# EAGLE design serialstick (EAGLE 5.11)
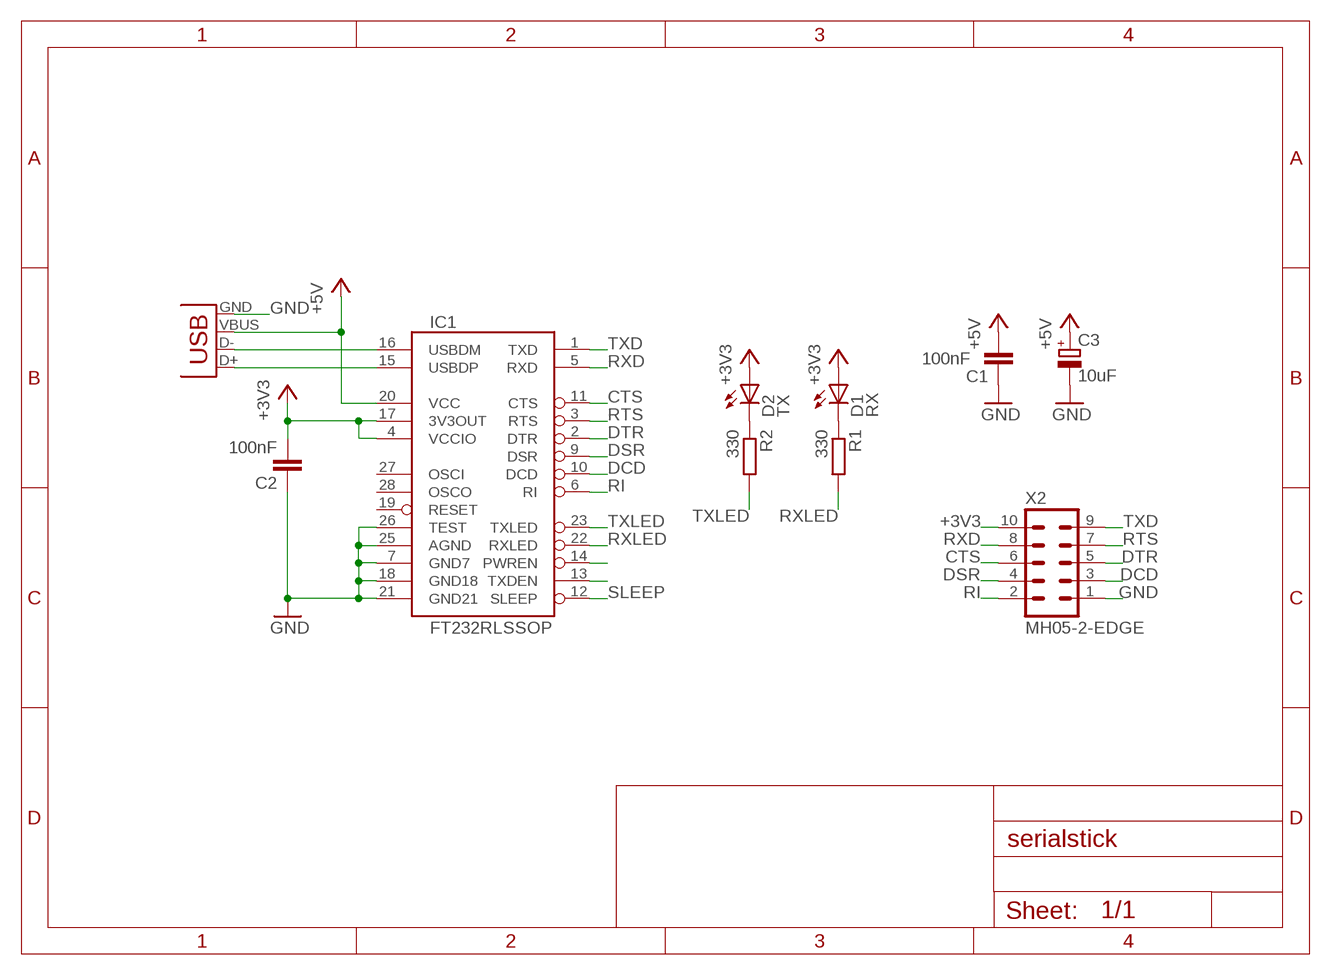
[diagram p0: schematic, sheet 1]

## Parts
C1  100nF  C-EUC0603  [C0603]
C2  100nF  C-EUC0603  [C0603]
C3  10uF  CPOL-EUSMCA  [SMC_A]
D1  RX  LED1206  [1206]
D2  TX  LED1206  [1206]
IC1  FT232RLSSOP  [SSOP28DB]
R1  330  R-EU_R0603  [R0603]
R2  330  R-EU_R0603  [R0603]
X1  USBSMD  [USB-MINIB]
X2  MH05-2-EDGE  [MH05-2-EDGE]

## Nets
+3V3: C2.2 D1.A D2.A IC1.4(VCCIO) IC1.17(3V3OUT) X2.10
+5V: C1.2 C3.+ IC1.20(VCC) X1.VBUS
CTS: IC1.11(CTS) X2.6
DCD: IC1.10(DCD) X2.3
DSR: IC1.9(DSR) X2.4
DTR: IC1.2(DTR) X2.5
GND: C1.1 C2.1 C3.- IC1.7(GND7) IC1.18(GND18) IC1.21(GND21) IC1.25(AGND) IC1.26(TEST) X1.GND X2.1
N$1: IC1.15(USBDP) X1.D+
N$2: IC1.16(USBDM) X1.D-
N$4: D1.C R1.1
N$12: D2.C R2.1
N$14: IC1.14(PWREN)
N$16: IC1.13(TXDEN)
RI: IC1.6(RI) X2.2
RTS: IC1.3(RTS) X2.7
RXD: IC1.5(RXD) X2.8
RXLED: IC1.22(RXLED) R1.2
SLEEP: IC1.12(SLEEP)
TXD: IC1.1(TXD) X2.9
TXLED: IC1.23(TXLED) R2.2
Unconnected: IC1.19(RESET) IC1.27(OSCI) IC1.28(OSCO)

## Library data of the parts
C1 C2 = rcl:C-EU: CAPACITOR, European symbol
C3 = rcl:CPOL-EU: POLARIZED CAPACITOR, European symbol
D1 D2 = Opto:LED
IC1 = SparkFun copy:FT232RL: USB UART FT232RL 4th Generation USB UART (USB <-> Serial) Controller. Spark Fun Electronics SKU : COM-00650
R1 R2 = rcl:R-EU_: RESISTOR, European symbol
X1 = SparkFun copy:USB: USB Connectors USB-B-PTH is fully proven SKU : PRT-00139 USB-miniB is fully proven SKU : PRT-00587 USB-A-PCB is untested. USB-A-H is throughly reviewed, but untested. Spark Fun Electronics SKU : PRT-00437 USB-B-SMT is throughly reviewed, but untested. Needs silkscreen touching up. USB-A-S has not been used/tested USB-MB-H has not been used/tested
X2 = Connectors:MH05-2; ONECALL: 3419216

## Board
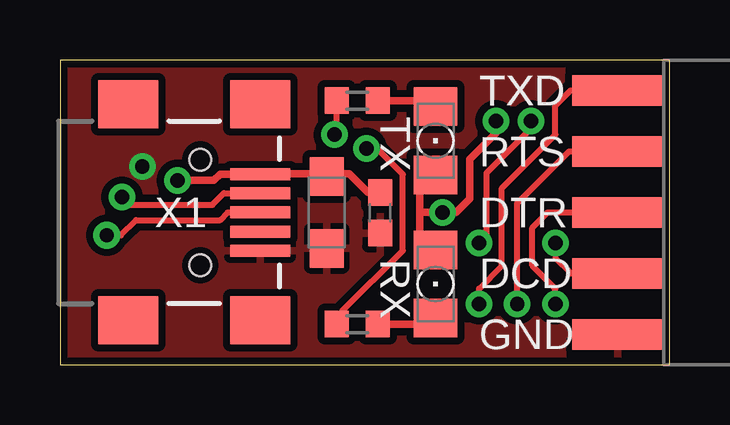
[diagram p1: board, top side]
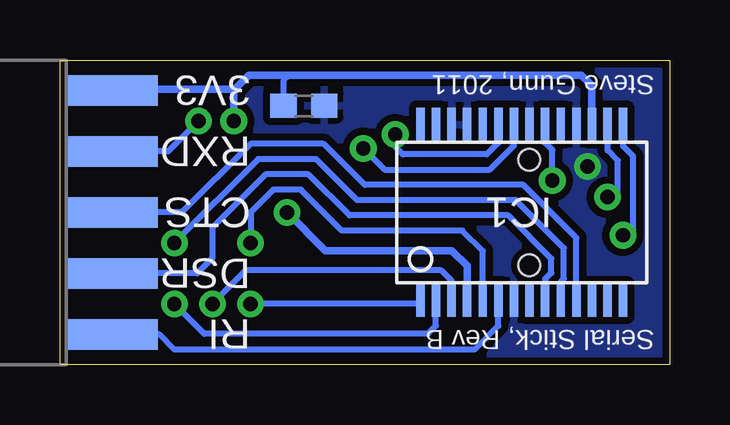
[diagram p2: board, bottom side, seen from below]

Size 25.4 x 12.7 mm. Coordinates in mm from the lower left corner, seen from the top.
Outline: 0,0 25.4,0 25.4,12.7 0,12.7 0,0
Copper layers (1*16): Top 0.035mm / dielectric 1.5mm / Bottom 0.035mm
Design rules "srg": minimum track width 8mil, minimum drill 20mil, track to track 8mil, track to pad 8mil, pad to pad 8mil, via to via 8mil, smd to smd 8mil, copper to edge 10mil, drill to drill 8mil, minimum pad ring 12mil, minimum via ring 10mil, stop-mask expansion 4mil, vias tented up to drill 25mil, thermal gap 10mil
tRestrict: area 21.3,2 to 25.1,3

### Footprints (pad centres in the part's own frame; a part is rotated, then mirrored left to right if it is on the bottom)
C0603 = smd 1.1 x 1: 1 -0.85,0; 2 0.85,0
SMC_A = smd 1.6 x 1.4: + -1.5,0; - 1.5,0
1206 = smd 1.6 x 1.803: A -1.422,0; C 1.422,0
SSOP28DB = smd 0.348 x 1.397: 1 -4.225,-3.656; 2 -3.575,-3.656; 3 -2.925,-3.656; 4 -2.275,-3.656; 5 -1.625,-3.656; 6 -0.975,-3.656; 7 -0.325,-3.656; 8 0.325,-3.656; 9 0.975,-3.656; 10 1.625,-3.656; 11 2.275,-3.656; 12 2.925,-3.656; 13 3.575,-3.656; 14 4.225,-3.656; 15 4.225,3.656; 16 3.575,3.656; 17 2.925,3.656; 18 2.275,3.656; 19 1.625,3.656; 20 0.975,3.656; 21 0.325,3.656; 22 -0.325,3.656; 23 -0.975,3.656; 24 -1.625,3.656; 25 -2.275,3.656; 26 -2.925,3.656; 27 -3.575,3.656; 28 -4.225,3.656
R0603 = smd 1 x 1.1: 1 -0.85,0; 2 0.85,0
USB-MINIB = smd 2.5 x 0.5: D+ 2.5,0; D- 2.5,0.8; GND 2.5,-1.6; ID 2.5,-0.8; VBUS 2.5,1.6 | smd 2.5 x 2: GND@1 -3,-4.5; GND@2 -3,4.5; GND@3 2.5,4.5; GND@4 2.5,-4.5 | hole 0.9: 0,2.2; 0,-2.2
MH05-2-EDGE = smd 1.27 x 3.81: 1 5.08,-0.254; 3 2.54,-0.254; 5 0,-0.254; 7 -2.54,-0.254; 9 -5.08,-0.254 | smd 1.27 x 3.81 bottom: 2 5.08,-0.254; 4 2.54,-0.254; 6 0,-0.254; 8 -2.54,-0.254; 10 -5.08,-0.254

### Placement (x,y rotation side)
C1  13.34,6.34 90 top
C2  15.24,10.79 180 bottom
C3  11.11,6.35 270 top
D1  15.65,3.37 270 top
D2  15.65,9.33 90 top
IC1  6.16,6.35 0 bottom
R1  12.38,1.69 180 top
R2  12.38,11.01 180 top
X1  5.84,6.35 0 top
X2  23.5,6.35 270 top

### Tracks (layer width: path | path; a pad name or v marks a point on that pad's centre or on a via)
+3V3  (via drill 0.6)
  Top 0.305: 14.99,6.35 v15.94,6.35 16.51,6.35 17.08,6.92 17.08,8.57 18.16,9.65 v18.16,10.16 | D2.A 14.99,7.25 14.99,6.35 | D1.A 14.99,5.45 14.99,6.35
  Bottom 0.254: 23.19,11.48 X2.10 | 3.23,11.62 3.29,11.68 | C2.2 16.09,11.85 15.88,12.06
  Bottom 0.305: 3.29,11.68 3.68,12.06 15.88,12.06 17.53,12.06 18.16,11.43 | IC1.17 3.23,11.62 | 18.16,11.43 v18.16,10.16 | 18.16,11.43 18.16,11.48 23.19,11.48 | IC1.4 8.43,4.12 9.07,4.76 14.35,4.76 v15.94,6.35
+5V  (via drill 0.6)
  Top 0.254: C1.2 13.22,7.3 | C3.+ 11.21,7.95 11.43,7.95
  Top 0.305: v4.88,7.68 v4.89,7.68 6.41,7.68 6.67,7.94 7.62,7.94 7.63,7.95 X1.VBUS 11.21,7.95 | 11.43,7.95 12.05,7.95 12.82,7.19 C1.2
  Bottom 0.254: IC1.20 5.18,9.25 4.89,8.95 v4.89,7.68
CTS
  Bottom 0.254: X2.6 20.32,6.35 17.46,9.21 14.41,9.21 12.7,7.49 6.09,7.49 3.88,5.29 IC1.11
DCD  (via drill 0.6)
  Top 0.254: v20.64,5.08 20.64,4.45 21.27,3.81 X2.3
  Bottom 0.254: v20.64,5.08 17.14,8.57 14.73,8.57 13.02,6.86 6.41,6.86 4.41,4.86 4.41,3.59 4.54,3.47 IC1.10
DSR
  Bottom 0.254: X2.4 19.68,3.81 19.05,4.45 19.05,5.71 16.83,7.94 15.05,7.94 13.34,6.22 6.72,6.22 4.93,4.43 4.93,3.83 5.18,3.58 IC1.9
DTR  (via drill 0.6)
  Top 0.254: X2.5 20.32,6.35 19.68,5.71 19.68,4.13 20.64,3.17 v20.64,2.54
  Bottom 0.254: IC1.2 9.73,1.63 10.08,1.29 19.39,1.29 v20.64,2.54
GND  (via drill 0.6)
  other vias: 3.43,8.26
  pour Bottom (isolate 0.305): 0,12.7 25.4,12.7 25.4,0 0,0
  pour Top (isolate 0.305): 0,12.7 25.4,12.7 25.4,0 0,0
N$1  (via drill 0.6)
  Top 0.254: X1.D+ 6.99,6.35 6.67,6.03 3.17,6.03 2.54,5.4 v1.95,5.4
  Bottom 0.254: IC1.15 1.94,9.11 1.52,8.7 1.52,5.4 v1.95,5.4
N$2  (via drill 0.6)
  Top 0.254: X1.D- 6.83,7.15 6.35,6.67 2.9,6.67 v2.58,6.99
  Bottom 0.254: v2.58,6.99 2.16,6.99 2.16,8.51 2.58,8.93 IC1.16
N$4
  Top 0.254: 15.07,1.59 15.43,1.94 D1.C
  Top 0.305: R1.1 15.4,1.69 D1.C
N$12
  Top 0.254: 15.07,11.11 15.43,10.76 D2.C
  Top 0.305: R2.1 15.4,11.01 D2.C
RI
  Bottom 0.254: X2.2 21.27,1.27 20.64,0.64 8.12,0.64 7.13,1.62 IC1.6
RTS  (via drill 0.6)
  Top 0.254: X2.7 21.21,8.89 19.05,6.73 v19.05,2.54
  Bottom 0.254: IC1.3 9.09,3.5 9.52,3.94 17.65,3.94 v19.05,2.54
RXD  (via drill 0.6)
  Top 0.254: v17.46,5.08 17.78,5.4 17.78,8 19.62,9.84 v19.62,10.16
  Bottom 0.254: v17.46,5.08 17.46,6.35 16.51,7.3 15.37,7.3 13.65,5.59 8.63,5.59 7.79,4.74 IC1.5 | X2.8 20.89,8.89 v19.62,10.16
RXLED  (via drill 0.6)
  Top 0.254: v12.76,9.02 13.21,9.02 14.29,7.94 14.29,4.76 11.75,2.22 11.75,1.91 R1.2
  Bottom 0.254: v12.76,9.02 11.87,8.13 7.49,8.13 6.48,9.14 IC1.22
TXD  (via drill 0.6)
  Top 0.254: X2.9 21.27,11.43 20.64,10.79 20.64,9.59 18.41,7.37 18.41,4.13 17.46,3.17 v17.46,2.54
  Bottom 0.254: v17.46,2.54 10.44,2.54 10.38,2.6 IC1.1
TXLED  (via drill 0.6)
  Top 0.254: R2.2 11.54,9.7 v11.43,9.59
  Bottom 0.254: v11.43,9.59 11.43,9.08 11.11,8.76 7.62,8.76 7.13,9.25 IC1.23

### Text on the board
tPlace: TXD | TXD | RTS | DTR | DCD | GND
bPlace: Steve Gunn, 2011 | 3V3 | RXD | CTS | DSR | RI | Serial Stick, Rev B